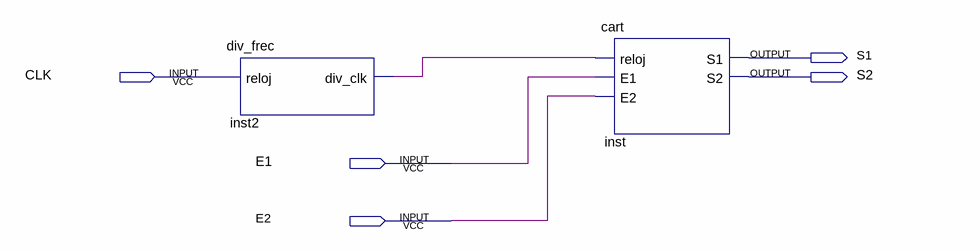
[diagram p0: schematic sheet]
// Quartus schematic Practica2_VHDL.bdf as structural Verilog: 2 symbols, 5 pins
module Practica2_VHDL (
  input  CLK,
  input  E1,
  input  E2,
  output S1,
  output S2
);

  wire inst2_div_clk;

  div_frec inst2 (.reloj(CLK), .div_clk(inst2_div_clk));
  cart inst (.reloj(inst2_div_clk), .E1(E1), .E2(E2), .S1(S1), .S2(S2));
endmodule
